# Altium schematic sheet Sheet1.SchDoc
size A3; SheetNumber: 1; SheetTotal: 1
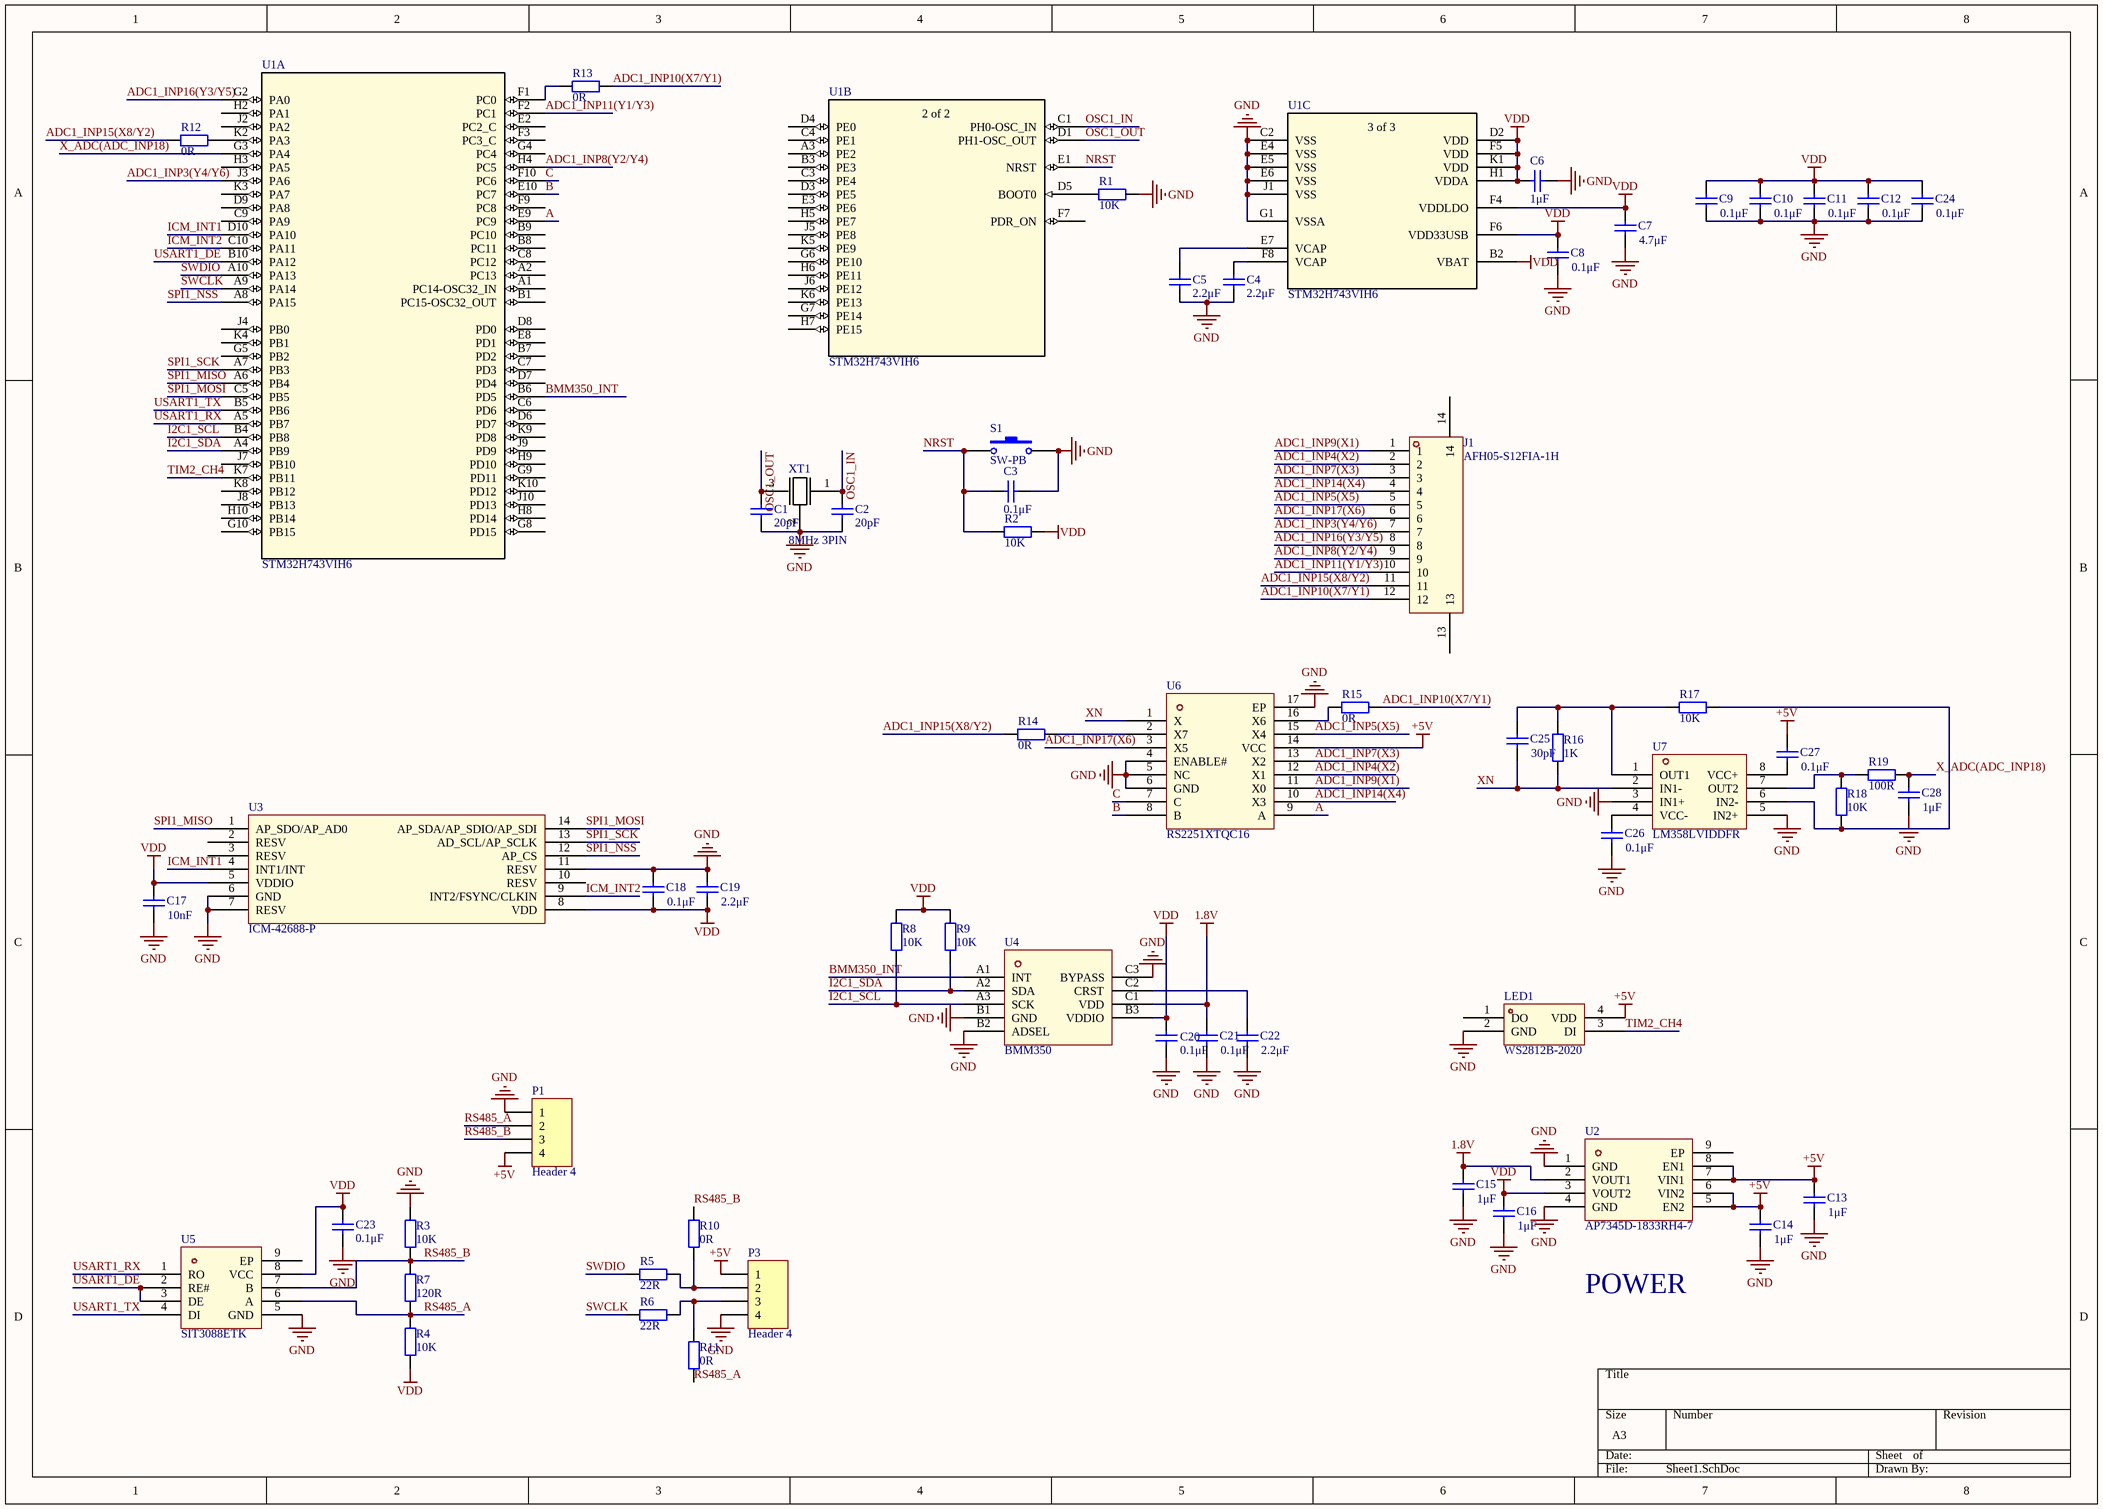
[diagram p0: Sheet1.SchDoc]

## Parts
C1  20pF  [C0402]
C2  20pF  [C0402]
C3  0.1μF  [C0402]
C4  2.2μF  [C0402]
C5  2.2μF  [C0402]
C6  1μF  [C0402]
C7  4.7μF  [C0402]
C8  0.1μF  [C0402]
C9  0.1μF  [C0402]
C10  0.1μF  [C0402]
C11  0.1μF  [C0402]
C12  0.1μF  [C0402]
C13  1μF  [C0402]
C14  1μF  [C0402]
C15  1μF  [C0402]
C16  1μF  [C0402]
C17  10nF  [C0402]
C18  0.1μF  [C0402]
C19  2.2μF  [C0402]
C20  0.1μF  [C0402]
C21  0.1μF  [C0402]
C22  2.2μF  [C0402]
C23  0.1μF  [C0402]
C24  0.1μF  [C0402]
C25  30pF  [C0402]
C26  0.1μF  [C0402]
C27  0.1μF  [C0402]
C28  1μF  [C0402]
J1  AFH05-S12FIA-1H  [FPC-SMD_12P-P0.50_GT-F0501SR10-12S1101]
LED1  WS2812B-2020  [LED-SMD_4P-L2.0-W2.0-TL_WS2812B-2020]
P1  Header 4  [CONN-SMD_XDWF-0910-04P]
P3  Header 4  [CONN-SMD_XDWF-0910-04P]
R1  10K  [R0402]
R2  10K  [R0402]
R3  10K  [R0402]
R4  10K  [R0402]
R5  22R  [R0402]
R6  22R  [R0402]
R7  120R  [R0402]
R8  10K  [R0402]
R9  10K  [R0402]
R10  0R  [R0402]
R11  0R  [R0402]
R12  0R  [R0402]
R13  0R  [R0402]
R14  0R  [R0402]
R15  0R  [R0402]
R16  1K  [R0402]
R17  10K  [R0402]
R18  10K  [R0402]
R19  100R  [R0402]
S1  SW-PB  [SW-SMD_L3.9-W3.0-P4.45]
U1  STM32H743VIH6  [TFBGA100]  (parts A,B,C of 3)
U2  AP7345D-1833RH4-7  [XDFN-8_L1.6-W1.2-P0.40-BL-EP]
U3  ICM-42688-P  [LGA-14_L3.0-W2.5-P0.50-TL]
U4  BMM350  [WLCSP-9_L1.3-W1.3-R3-C3-P0.40-TL]
U5  SIT3088ETK  [DFN-8_L3.0-W3.0-P0.65-BL-EP]
U6  RS2251XTQC16  [QFN-16_L3.0-W3.0-P0.50-BL-EP1.7]
U7  LM358LVIDDFR  [SOT-23-8_L2.9-W1.6-P0.65-LS2.8-BR]
XT1  8MHz 3PIN  [8MHz 0.07% OSC-SMD_3P-L3.2-W1.3-P1.20-L]

## Nets
1.8V: C15.2 C21.2 U2.2(VOUT1) U4.C1(VDD)
+5V: C13.2 C14.2 C27.2 LED1.4(VDD) P1.4 P3.1 U2.5(EN2) U2.6(VIN2) U2.7(VIN1) U2.8(EN1) U6.14(VCC)
GND: C1.1 C2.1 C3.2 C4.1 C5.1 C6.1 C7.1 C8.1 C9.1 C10.1 C11.1 C12.1 C13.1 C14.1 C15.1 C16.1 C17.1 C18.2 C19.2 C20.1 C21.1 C22.1 C23.1 C24.1 C26.1 C28.1 LED1.2(GND) P1.1 P3.4 R1.1 R3.1 S1.2 U1.C2(VSS) U1.E4(VSS) U1.E5(VSS) U1.E6(VSS) U1.G1(VSSA) U1.J1(VSS) U2.1(GND) U2.4(GND) U3.6(GND) U3.7(RESV) U3.11(RESV) U4.B1(GND) U4.B2(ADSEL) U4.C3(BYPASS) U5.5(GND) U6.4(ENABLE#) U6.5(NC) U6.6(GND) U6.17(EP) U7.3(IN1+) U7.5(IN2+) XT1.2(GND)
VDD: C6.2 C7.2 C8.2 C9.2 C10.2 C11.2 C12.2 C16.2 C17.2 C18.1 C19.1 C20.2 C23.2 C24.2 R2.2 R4.2 R8.1 R9.1 U1.B2(VBAT) U1.D2(VDD) U1.F4(VDDLDO) U1.F5(VDD) U1.F6(VDD33USB) U1.H1(VDDA) U1.K1(VDD) U2.3(VOUT2) U3.5(VDDIO) U3.8(VDD) U4.B3(VDDIO) U5.8(VCC)
A: U1.E9(PC9) U6.9(A)
ADC1_INP3(Y4/Y6): J1.7 U1.J3(PA6)
ADC1_INP4(X2): J1.2 U6.12(X1)
ADC1_INP5(X5): J1.5 U6.15(X4)
ADC1_INP7(X3): J1.3 U6.13(X2)
ADC1_INP8(Y2/Y4): J1.9 U1.H4(PC5)
ADC1_INP9(X1): J1.1 U6.11(X0)
ADC1_INP10(X7/Y1): J1.12 R13.1 R15.1
ADC1_INP11(Y1/Y3): J1.10 U1.F2(PC1)
ADC1_INP14(X4): J1.4 U6.10(X3)
ADC1_INP15(X8/Y2): J1.11 R12.2 R14.2
ADC1_INP16(Y3/Y5): J1.8 U1.G2(PA0)
ADC1_INP17(X6): J1.6 U6.3(X5)
B: U1.E10(PC7) U6.8(B)
BMM350_INT: U1.B6(PD5) U4.A1(INT)
C: U1.F10(PC6) U6.7(C)
I2C1_SCL: R8.2 U1.B4(PB8) U4.A3(SCK)
I2C1_SDA: R9.2 U1.A4(PB9) U4.A2(SDA)
ICM_INT1: U1.D10(PA10) U3.4(INT1/INT)
ICM_INT2: U1.C10(PA11) U3.9(INT2/FSYNC/CLKIN)
NRST: C3.1 R2.1 S1.1 U1.E1(NRST)
OSC1_IN: C2.2 U1.C1(PH0-OSC_IN) XT1.1(OUTPUT)
OSC1_OUT: C1.2 U1.D1(PH1-OSC_OUT) XT1.3(INPUT)
RS485_A: P1.2 R4.1 R7.1 R11.1 U5.6(A)
RS485_B: P1.3 R3.2 R7.2 R10.2 U5.7(B)
SPI1_MISO: U1.A6(PB4) U3.1(AP_SDO/AP_AD0)
SPI1_MOSI: U1.C5(PB5) U3.14(AP_SDA/AP_SDIO/AP_SDI)
SPI1_NSS: U1.A8(PA15) U3.12(AP_CS)
SPI1_SCK: U1.A7(PB3) U3.13(AD_SCL/AP_SCLK)
SWCLK: R6.1 U1.A9(PA14)
SWDIO: R5.1 U1.A10(PA13)
TIM2_CH4: LED1.3(DI) U1.K7(PB11)
USART1_DE: U1.B10(PA12) U5.2(RE#) U5.3(DE)
USART1_RX: U1.A5(PB7) U5.1(RO)
USART1_TX: U1.B5(PB6) U5.4(DI)
X_ADC(ADC_INP18): C28.2 R19.2 U1.G3(PA4)
XN: C25.1 R16.1 U6.1(X) U7.2(IN1-)
NetC4_2: C4.2 U1.F8(VCAP)
NetC5_2: C5.2 U1.E7(VCAP)
NetC22_2: C22.2 U4.C2(CRST)
NetC25_2: C25.2 R16.2 R17.1 U7.1(OUT1)
NetC26_2: C26.2 U7.4(VCC-)
NetC27_1: C27.1 U7.8(VCC+)
NetP3_2: P3.2 R5.2 R10.1
NetP3_3: P3.3 R6.2 R11.2
NetR1_2: R1.2 U1.D5(BOOT0)
NetR12_1: R12.1 U1.K2(PA3)
NetR13_2: R13.2 U1.F1(PC0)
NetR14_1: R14.1 U6.2(X7)
NetR15_2: R15.2 U6.16(X6)
NetR17_2: R17.2 R18.1 U7.6(IN2-)
NetR18_2: R18.2 R19.1 U7.7(OUT2)

Not connected (* = marked no-connect by the designer): J1 13 14; LED1 1(DO); U1 A1(PC14-OSC32_IN) A2(PC13) A3(PE2) B1(PC15-OSC32_OUT) B3(PE3) B7(PD2) B8(PC11) B9(PC10) C3(PE4) C4(PE1) C6(PD6) C7(PD3) C8(PC12) C9(PA9) D3(PE5) D4(PE0) D6(PD7) D7(PD4) D8(PD0) D9(PA8) E2(PC2_C) E3(PE6) E8(PD1) F3(PC3_C) F7(PDR_ON) F9(PC8) G4(PC4) G5(PB2) G6(PE10) G7(PE14) G8(PD15) G9(PD11) G10(PB15) H2(PA1) H3(PA5) H5(PE7) H6(PE11) H7(PE15) H8(PD14) H9(PD10) H10(PB14) J2(PA2) J4(PB0) J5(PE8) J6(PE12) J7(PB10) J8(PB13) J9(PD9) J10(PD13) K3(PA7) K4(PB1) K5(PE9) K6(PE13) K8(PB12) K9(PD8) K10(PD12); U2 9(EP); U3 2(RESV) 3(RESV) 10(RESV); U5 9(EP)

## Notes on the sheet
- POWER
- (in symbol STM32H743VIH6, part B) 2 of 2
- (in symbol STM32H743VIH6, part C) 3 of 3

## Library data of the parts
C1-C28 = Cap Semi: Capacitor (Semiconductor SIM Model); Published: 8-Jun-2000; LatestRevisionDate: 29-May-2009; LatestRevisionNote: IPC-7351 Footprint Added.; PackageReference: C1206; Publisher: Altium Limited; PackageDescription: Chip Capacitor
P1 P3 = Header 4: XDWF-0910-04P; LatestRevisionDate: 17-Jul-2002; LatestRevisionNote: Re-released for DXP Platform.; Publisher: Altium Limited
R1-R11 R16-R19 = Res2: Resistor; Published: 8-Jun-2000; LatestRevisionDate: 17-Jul-2002; LatestRevisionNote: Re-released for DXP Platform.; PackageReference: AXIAL-0.4; Publisher: Altium Limited; PackageDescription: Axial Device, Thru-Hole; 2 Leads; 0.4 in Pin Spacing
R12 = Res2: Resistor / 6x6 Y2; Published: 8-Jun-2000; LatestRevisionDate: 17-Jul-2002; LatestRevisionNote: Re-released for DXP Platform.; PackageReference: AXIAL-0.4; Publisher: Altium Limited; PackageDescription: Axial Device, Thru-Hole; 2 Leads; 0.4 in Pin Spacing
R13 = Res2: Resistor / 6x6 Y1; Published: 8-Jun-2000; LatestRevisionDate: 17-Jul-2002; LatestRevisionNote: Re-released for DXP Platform.; PackageReference: AXIAL-0.4; Publisher: Altium Limited; PackageDescription: Axial Device, Thru-Hole; 2 Leads; 0.4 in Pin Spacing
R14 = Res2: Resistor / 4x8 X8; Published: 8-Jun-2000; LatestRevisionDate: 17-Jul-2002; LatestRevisionNote: Re-released for DXP Platform.; PackageReference: AXIAL-0.4; Publisher: Altium Limited; PackageDescription: Axial Device, Thru-Hole; 2 Leads; 0.4 in Pin Spacing
R15 = Res2: Resistor / 4x8 X7; Published: 8-Jun-2000; LatestRevisionDate: 17-Jul-2002; LatestRevisionNote: Re-released for DXP Platform.; PackageReference: AXIAL-0.4; Publisher: Altium Limited; PackageDescription: Axial Device, Thru-Hole; 2 Leads; 0.4 in Pin Spacing
S1 = SW-PB: TS-1088R-02026; Published: 24-Mar-1999; LatestRevisionDate: 17-Jul-2002; LatestRevisionNote: Re-released for DXP Platform.; PackageReference: SPST-2; Publisher: Altium Limited; PackageDescription: Switch; 2 Leads
U1 = STM32H743VIH6: No Description Available; Mfr_Name: STMicroelectronics; RefDes: RefDes; Type: Type
XT1 = 8MHz 0.07% 3PIN_1: CSTNE8M00GH5C000R0